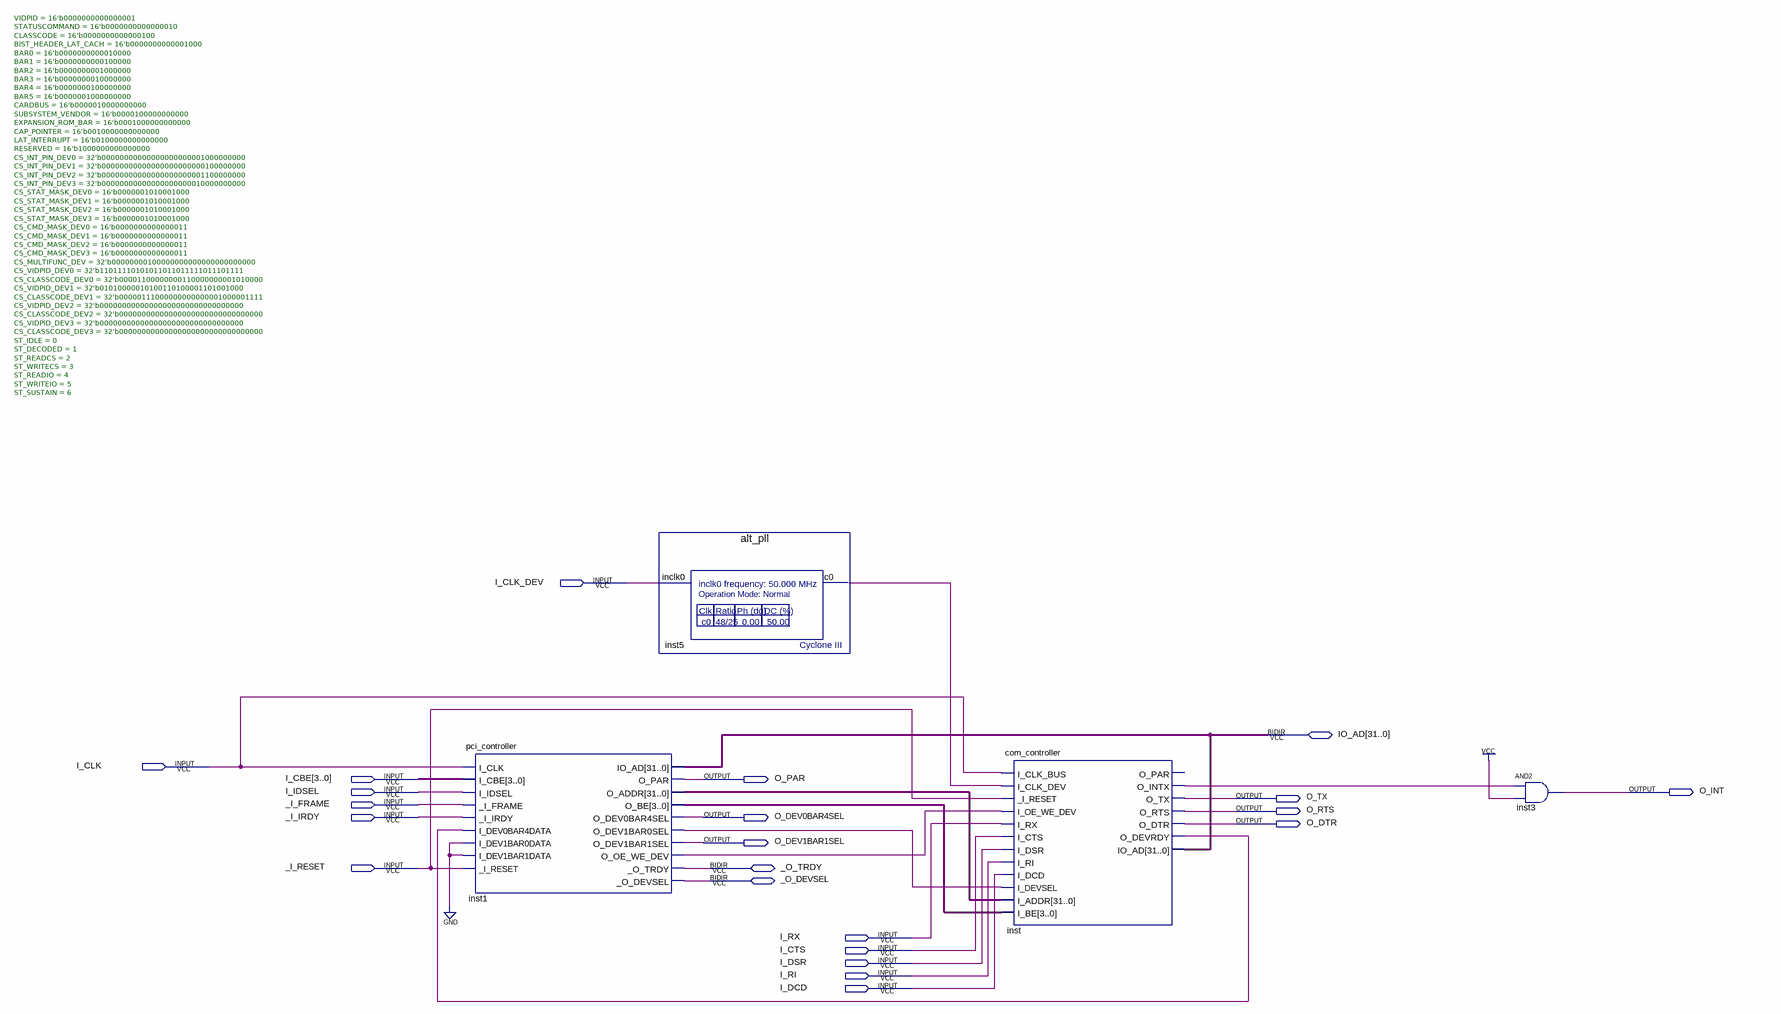
[diagram p0: schematic sheet]
// Quartus schematic pci_com_lpt_usb_eth.bdf as structural Verilog: 4 symbols, 22 pins
module pci_com_lpt_usb_eth (
  input  I_CLK_DEV,
  input  I_CLK,
  input  [3:0] I_CBE,
  input  I_IDSEL,
  input  _I_FRAME,
  input  _I_IRDY,
  input  _I_RESET,
  input  I_RX,
  input  I_CTS,
  input  I_DSR,
  input  I_RI,
  input  I_DCD,
  inout  [31:0] IO_AD,
  inout  _O_TRDY,
  inout  _O_DEVSEL,
  output O_PAR,
  output O_INT,
  output O_TX,
  output O_RTS,
  output O_DEV0BAR4SEL,
  output O_DTR,
  output O_DEV1BAR1SEL
);

  wire inst1_o_dev1bar0sel, inst1_o_oe_we_dev, inst5_c0, inst_o_devrdy, inst_o_intx;
  wire [3:0] inst1_o_be;
  wire [31:0] inst1_o_addr;

  pci_controller #(.VIDPID(16'b0000000000000001), .STATUSCOMMAND(16'b0000000000000010), .CLASSCODE(16'b0000000000000100), .BIST_HEADER_LAT_CACH(16'b0000000000001000), .BAR0(16'b0000000000010000), .BAR1(16'b0000000000100000), .BAR2(16'b0000000001000000), .BAR3(16'b0000000010000000), .BAR4(16'b0000000100000000), .BAR5(16'b0000001000000000), .CARDBUS(16'b0000010000000000), .SUBSYSTEM_VENDOR(16'b0000100000000000), .EXPANSION_ROM_BAR(16'b0001000000000000), .CAP_POINTER(16'b0010000000000000), .LAT_INTERRUPT(16'b0100000000000000), .RESERVED(16'b1000000000000000), .CS_INT_PIN_DEV0(32'b00000000000000000000001000000000), .CS_INT_PIN_DEV1(32'b00000000000000000000000100000000), .CS_INT_PIN_DEV2(32'b00000000000000000000001100000000), .CS_INT_PIN_DEV3(32'b00000000000000000000010000000000), .CS_STAT_MASK_DEV0(16'b0000001010001000), .CS_STAT_MASK_DEV1(16'b0000001010001000), .CS_STAT_MASK_DEV2(16'b0000001010001000), .CS_STAT_MASK_DEV3(16'b0000001010001000), .CS_CMD_MASK_DEV0(16'b0000000000000011), .CS_CMD_MASK_DEV1(16'b0000000000000011), .CS_CMD_MASK_DEV2(16'b0000000000000011), .CS_CMD_MASK_DEV3(16'b0000000000000011), .CS_MULTIFUNC_DEV(32'b00000000100000000000000000000000), .CS_VIDPID_DEV0(32'b11011110101011011011111011101111), .CS_CLASSCODE_DEV0(32'b00001100000000110000000001010000), .CS_VIDPID_DEV1(32'b01010000010100110100001101001000), .CS_CLASSCODE_DEV1(32'b00000111000000000000001000001111), .CS_VIDPID_DEV2(32'b00000000000000000000000000000000), .CS_CLASSCODE_DEV2(32'b00000000000000000000000000000000), .CS_VIDPID_DEV3(32'b00000000000000000000000000000000), .CS_CLASSCODE_DEV3(32'b00000000000000000000000000000000), .ST_IDLE(0), .ST_DECODED(1), .ST_READCS(2), .ST_WRITECS(3), .ST_READIO(4), .ST_WRITEIO(5), .ST_SUSTAIN(6)) inst1 (
    .I_CLK(I_CLK), .I_CBE(I_CBE), .I_IDSEL(I_IDSEL), ._I_FRAME(_I_FRAME), ._I_IRDY(_I_IRDY),
    .I_DEV0BAR4DATA(inst_o_devrdy), .I_DEV1BAR0DATA(1'b0), .I_DEV1BAR1DATA(1'b0), ._I_RESET(_I_RESET),
    .O_PAR(O_PAR), .O_ADDR(inst1_o_addr), .O_BE(inst1_o_be), .O_DEV0BAR4SEL(O_DEV0BAR4SEL),
    .O_DEV1BAR0SEL(inst1_o_dev1bar0sel), .O_DEV1BAR1SEL(O_DEV1BAR1SEL), .O_OE_WE_DEV(inst1_o_oe_we_dev),
    ._O_TRDY(_O_TRDY), ._O_DEVSEL(_O_DEVSEL), .IO_AD(IO_AD));
  alt_pll inst5 (.inclk0(I_CLK_DEV), .c0(inst5_c0));
  com_controller inst (
    .I_CLK_BUS(I_CLK), .I_CLK_DEV(inst5_c0), ._I_RESET(_I_RESET), .I_OE_WE_DEV(inst1_o_oe_we_dev),
    .I_RX(I_RX), .I_CTS(I_CTS), .I_DSR(I_DSR), .I_RI(I_RI), .I_DCD(I_DCD), .I_DEVSEL(inst1_o_dev1bar0sel),
    .I_ADDR(inst1_o_addr), .I_BE(inst1_o_be), .O_INTX(inst_o_intx), .O_TX(O_TX), .O_RTS(O_RTS),
    .O_DTR(O_DTR), .O_DEVRDY(inst_o_devrdy), .IO_AD(IO_AD));  // open: O_PAR
  and inst3 (O_INT, inst_o_intx, 1'b1);
endmodule
